# EAGLE schematic 4017 Module (EAGLE 7.6.0)
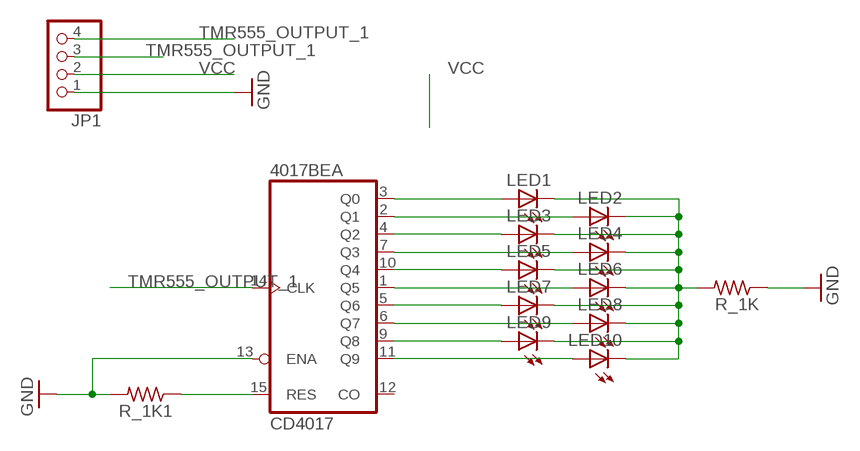
[diagram p0: schematic, sheet 1]

## Parts
4017BE  CD4017  [DIL16]
JP1  PINHD-1X4  [1X04]
LED1  LEDSMT1206  [1206]
LED2  LEDSMT1206  [1206]
LED3  LEDSMT1206  [1206]
LED4  LEDSMT1206  [1206]
LED5  LEDSMT1206  [1206]
LED6  LEDSMT1206  [1206]
LED7  LEDSMT1206  [1206]
LED8  LEDSMT1206  [1206]
LED9  LEDSMT1206  [1206]
LED10  LEDSMT1206  [1206]
R_1K  R-US_R1206  [R1206]
R_1K1  R-US_R1206  [R1206]

## Nets
GND: 4017BE.13(A:ENA) JP1.1 R_1K1.2 R_1K.1
N$1: 4017BE.3(A:Q0) LED1.A
N$2: 4017BE.2(A:Q1) LED2.A
N$3: 4017BE.4(A:Q2) LED3.A
N$4: 4017BE.7(A:Q3) LED4.A
N$5: 4017BE.10(A:Q4) LED5.A
N$6: 4017BE.1(A:Q5) LED6.A
N$7: 4017BE.5(A:Q6) LED7.A
N$8: 4017BE.6(A:Q7) LED8.A
N$9: 4017BE.9(A:Q8) LED9.A
N$10: 4017BE.11(A:Q9) LED10.A
N$11: LED1.C LED2.C LED3.C LED4.C LED5.C LED6.C LED7.C LED8.C LED9.C LED10.C R_1K.2
N$13: 4017BE.15(A:RES) R_1K1.1
TMR555_OUTPUT_1: 4017BE.14(A:CLK) JP1.3 JP1.4
VCC: JP1.2
Unconnected: 4017BE.12(A:CO)

## Power pins joined to a net without a drawn wire
GND: 4017BE.8(P:GND)
VCC: 4017BE.16(P:VCC)

## Library data of the parts
4017BE = SparkFun-DigitalIC:CD4017; PROD_ID: IC-11929
JP1 = pinhead:PINHD-1X4: PIN HEADER
LED1-LED10 = adafruit:LED: LED OSRAM: - CHIPLED LG R971, LG N971, LY N971, LG Q971, LY Q971, LO R971, LY R971 LH N974, LH R974 LS Q976, LO Q976, LY Q976 LO Q996 - Hyper CHIPLED LW Q18S LB Q993, LB Q99A, LB R99A - SideLED LS A670, LO A670, LY A670, LG A670, LP A670 LB A673, LV A673, LT A673, LW A673 LH A674 LY A675 LS A676, LA A676, LO A676, LY A676, LW A676 LS A679, LY A679, LG A679 - Hyper Micro SIDELED® LS Y876, LA Y876, LO Y876, LY Y876 LT Y87S - SmartLED LW L88C, LW L88S LB L89C, LB L89S, LG L890 LS L89K, LO L89K, LY L89K LS L896, LA L896, LO L896, LY L896 - TOPLED LS T670, LO T670, LY T670, LG T670, LP T670 LSG T670, LSP T670, LSY T670, LOP T670, LYG T670 LG T671, LOG T671, LSG T671 LB T673, LV T673, LT T673, LW T673 LH T674 LS T676, LA T676, LO T676, LY T676, LB T676, LH T676, LSB T676, LW T676 LB T67C, LV T67C, LT T67C, LS T67K, LO T67K, LY T67K, LW E67C LS E67B, LA E67B, LO E67B, LY E67B, LB E67C, LV E67C, LT E67C LW T67C LS T679, LY T679, LG T679 LS T770, LO T770, LY T770, LG T770, LP T770 LB T773, LV T773, LT T773, LW T773 LH T774 LS E675, LA E675, LY E675, LS T675 LS T776, LA T776, LO T776, LY T776, LB T776 LHGB T686 LT T68C, LB T68C - Hyper Mini TOPLED® LB M676 - Mini TOPLED Santana® LG M470 LS M47K, LO M47K, LY M47K Source: http://www.osram.convergy.de/
R_1K R_1K1 = adafruit:R-US_: RESISTOR, American symbol